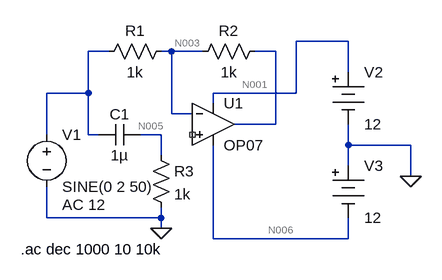
[diagram p0: schematic tarea0.asc]
tarea0.asc, the LTspice schematic file:
Version 4
SHEET 1 880 680
WIRE 400 32 320 32
WIRE 32 48 0 48
WIRE 128 48 112 48
WIRE 176 48 128 48
WIRE 288 48 256 48
WIRE 400 80 400 32
WIRE 0 112 0 48
WIRE 0 112 -64 112
WIRE 320 112 320 32
WIRE 320 112 192 112
WIRE 192 128 192 112
WIRE 128 144 128 48
WIRE 160 144 128 144
WIRE 288 160 288 48
WIRE 288 160 224 160
WIRE -64 176 -64 112
WIRE 0 176 0 112
WIRE 16 176 0 176
WIRE 112 176 80 176
WIRE 400 192 400 160
WIRE 496 192 400 192
WIRE 112 208 112 176
WIRE 400 224 400 192
WIRE 496 240 496 192
WIRE -64 304 -64 256
WIRE 112 304 112 288
WIRE 112 304 -64 304
WIRE 112 320 112 304
WIRE 192 336 192 192
WIRE 400 336 400 304
WIRE 400 336 192 336
FLAG 112 320 0
FLAG 496 240 0
SYMBOL OpAmps\\OP07 192 96 R0
SYMATTR InstName U1
SYMBOL res 128 32 R90
WINDOW 0 0 56 VBottom 2
WINDOW 3 32 56 VTop 2
SYMATTR InstName R1
SYMATTR Value 1k
SYMBOL res 160 64 R270
WINDOW 0 32 56 VTop 2
WINDOW 3 0 56 VBottom 2
SYMATTR InstName R2
SYMATTR Value 1k
SYMBOL voltage -64 160 R0
WINDOW 123 24 124 Left 2
WINDOW 39 0 0 Left 0
SYMATTR InstName V1
SYMATTR Value SINE(0 2 50)
SYMATTR Value2 AC 12
SYMBOL Misc\\battery 400 64 R0
WINDOW 123 0 0 Left 0
WINDOW 39 0 0 Left 0
SYMATTR InstName V2
SYMATTR Value 12
SYMBOL Misc\\battery 400 208 R0
WINDOW 123 0 0 Left 0
WINDOW 39 0 0 Left 0
SYMATTR InstName V3
SYMATTR Value 12
SYMBOL res 96 192 R0
SYMATTR InstName R3
SYMATTR Value 1k
SYMBOL cap 80 160 R90
WINDOW 0 0 32 VBottom 2
WINDOW 3 32 32 VTop 2
SYMATTR InstName C1
SYMATTR Value 1µ
TEXT -104 352 Left 2 !.ac dec 1000 10 10k

The netlist it stands for:
* tarea0.asc
XU1 NC_01 N003 N001 N006 N004 LT1001  ; OP07, pins In+ In- V+ V- OUT
R1 N003 N002 1k
R2 N003 N004 1k
V1 N002 0 SINE(0 2 50) AC 12
V2 N001 0 12
V3 0 N006 12
R3 N005 0 1k
C1 N005 N002 1µ
.ac dec 1000 10 10k
.lib LTC.lib
.backanno
.end

* Results of the author's LTspice run, read from the files saved beside the schematic
* Operating Point, zero values left out:
*   V(n001) = 12 V
*   V(n006) = -12 V
*   I(V3) = -2.25 mA
*   I(V2) = -2.25 mA
*   Ix(u1:3) = 2.25 mA
*   Ix(u1:4) = -2.25 mA
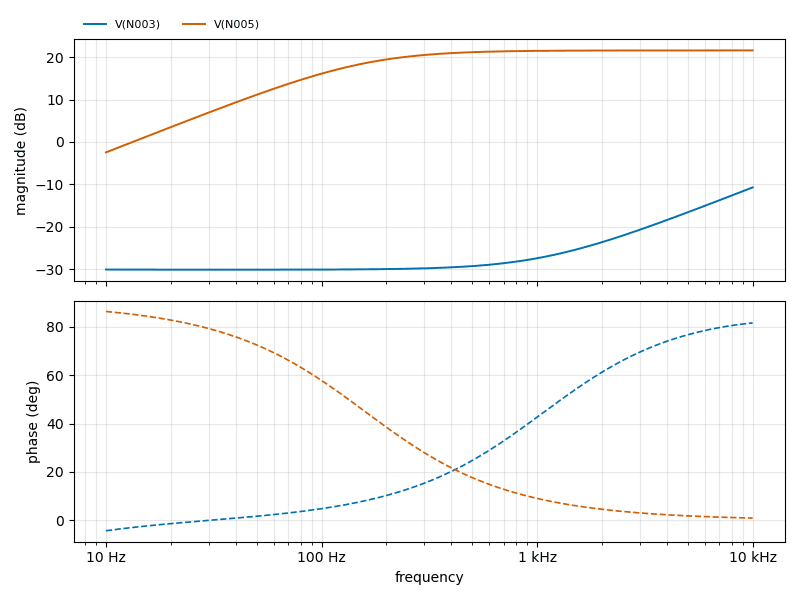
[diagram p1: AC Analysis of tarea0.asc, plotted from the saved traces]
* AC Analysis, 1 run:
*   V(N003): -30.09 dB at 10 Hz, -10.73 dB at 10 kHz, peak -10.73 dB at 10 kHz, 3 dB below the peak at 7.028 kHz
*   V(N005): -2.47 dB at 10 Hz, 21.58 dB at 10 kHz, peak 21.58 dB at 10 kHz, 3 dB below the peak at 159.1 Hz